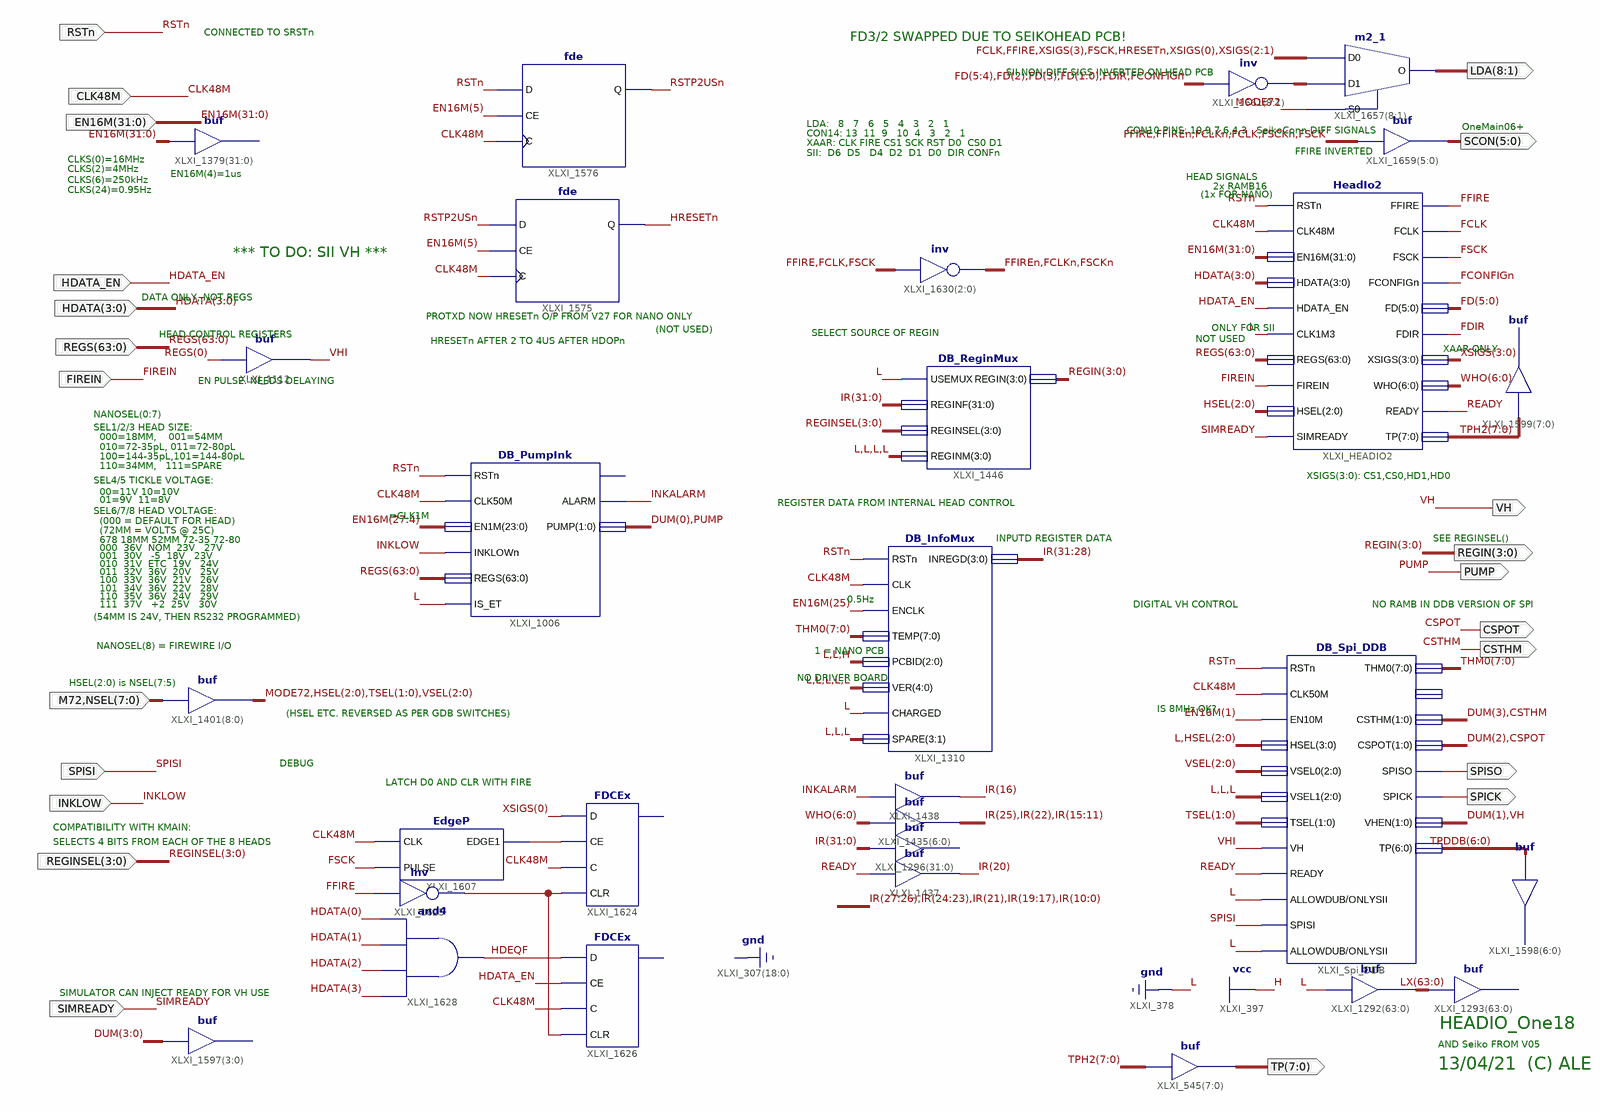
[diagram p0: schematic sheet 1]
// Xilinx ISE schematic HeadIo_One18.sch (spartan3e) as structural Verilog: 29 symbols, 22 ports
module HeadIo_One18 (
  input  CLK48M,
  input  RSTn,
  input  [3:0] HDATA,
  input  HDATA_EN,
  input  FIREIN,
  input  [63:0] REGS,
  input  INKLOW,
  input  M72,
  input  [7:0] NSEL,
  input  [3:0] REGINSEL,
  input  [31:0] EN16M,
  input  SPISI,
  input  SIMREADY,
  output [7:0] TP,
  output [3:0] REGIN,
  output PUMP,
  output VH,
  output SPISO,
  output SPICK,
  output [5:0] SCON,
  output [8:1] LDA,
  output CSPOT,
  output CSTHM
);

  wire FCLK, FCLKn, FCONFIGn, FDIR, FFIRE, FFIREn, FSCK, FSCKn, HDEQF, HRESETn, INKALARM, MODE72, READY,
       RSTP2USn, VHI, XLXN_68, XLXN_73;
  wire [1:0] TSEL;
  wire [2:0] HSEL, VSEL;
  wire [3:0] DUM, XSIGS;
  wire [5:0] FD;
  wire [6:0] TPDDB, WHO;
  wire [7:0] THM0, TPH2;
  wire [8:1] XLXN_75;
  wire [31:11] IR;
  wire [63:0] LX;

  assign TP = TPH2;  // buf XLXI_545[7..0], 8 bits wide
  assign {MODE72, HSEL, TSEL, VSEL} = {M72, NSEL};  // buf XLXI_1401[8..0], 9 bits wide
  // buf XLXI_1379[31..0] has open pins: I=EN16M, O=open
  fde XLXI_1575 (.C(CLK48M), .CE(EN16M[5]), .D(RSTP2USn), .Q(HRESETn));
  fde XLXI_1576 (.C(CLK48M), .CE(EN16M[5]), .D(RSTn), .Q(RSTP2USn));
  buf XLXI_1112 (VHI, REGS[0]);
  DB_PumpInk XLXI_1006 (
    .ALARM(INKALARM), .CLK50M(CLK48M), .EN1M(EN16M[27:4]), .INKLOWn(INKLOW), .IS_ET(1'b0),
    .PUMP({DUM[0], PUMP}), .REGS(REGS), .RSTn(RSTn));  // open: LEDINK
  // buf XLXI_1598[6..0] has open pins: I=TPDDB, O=open
  EdgeP XLXI_1607 (.CLK(CLK48M), .EDGE1(XLXN_68), .PULSE(FSCK));
  FDCEx XLXI_1624 (.C(CLK48M), .CE(XLXN_68), .CLR(XLXN_73), .D(XSIGS[0]));  // open: Q
  not XLXI_1625 (XLXN_73, FFIRE);
  FDCEx XLXI_1626 (.C(CLK48M), .CE(HDATA_EN), .CLR(XLXN_73), .D(HDEQF));  // open: Q
  and XLXI_1628 (HDEQF, HDATA[3], HDATA[2], HDATA[1], HDATA[0]);
  DB_ReginMux XLXI_1446 (
    .REGIN(REGIN),
    .REGINF({IR[31:28], 2'b00, IR[25], 2'b00, IR[22], 1'b0, IR[20], 3'b000, IR[16:11], {11{1'b0}}}),
    .REGINM(4'b0000), .REGINSEL(REGINSEL), .USEMUX(1'b0));
  buf XLXI_1437 (IR[20], READY);
  // buf XLXI_1296[31..0] has open pins: I={IR[31:28], 2'b00, IR[25], 2'b00, IR[22], 1'b0, IR[20], 3'b000, IR[16:11], {11{1'b0}}}, O=open
  assign {IR[25], IR[22], IR[15:11]} = WHO;  // buf XLXI_1435[6..0], 7 bits wide
  buf XLXI_1438 (IR[16], INKALARM);
  DB_InfoMux XLXI_1310 (
    .CLK(CLK48M), .ENCLK(EN16M[25]), .INREGD(IR[31:28]), .PCBID(3'b001), .RSTn(RSTn), .CHARGED(1'b0),
    .SPARE(3'b000), .TEMP(THM0), .VER({5{1'b0}}));
  assign {FFIREn, FCLKn, FSCKn} = ~{FFIRE, FCLK, FSCK};  // inv XLXI_1630[2..0], 3 bits wide
  // buf XLXI_1599[7..0] has open pins: I=TPH2, O=open
  HeadIo2 XLXI_HEADIO2 (
    .CLK1M3(1'b0), .CLK48M(CLK48M), .EN16M(EN16M), .FCLK(FCLK), .FCONFIGn(FCONFIGn), .FD(FD), .FDIR(FDIR),
    .FFIRE(FFIRE), .FIREIN(FIREIN), .FSCK(FSCK), .HDATA(HDATA), .HDATA_EN(HDATA_EN), .HSEL(HSEL),
    .READY(READY), .REGS(REGS), .RSTn(RSTn), .SIMREADY(SIMREADY), .TP(TPH2), .WHO(WHO), .XSIGS(XSIGS));
  // buf XLXI_1597[3..0] has open pins: I=DUM, O=open
  assign SCON = {FFIRE, FFIREn, FCLKn, FCLK, FSCKn, FSCK};  // buf XLXI_1659[5..0], 6 bits wide
  assign XLXN_75 = ~{FD[5:4], FD[2], FD[3], FD[1:0], FDIR, FCONFIGn};  // inv XLXI_1661[8..1], 8 bits wide
  m2_1 XLXI_1657[8:1] (
    .D0({FCLK, FFIRE, XSIGS[3], FSCK, HRESETn, XSIGS[0], XSIGS[2:1]}), .D1(XLXN_75), .S0(MODE72), .O(LDA));
  assign LX = {64{1'b0}};  // buf XLXI_1292[63..0], 64 bits wide
  // buf XLXI_1293[63..0] has open pins: I=LX, O=open
  DB_Spi_DDB XLXI_Spi_DDB (
    .ALLOWDUB(1'b0), .CLK50M(CLK48M), .CSPOT({DUM[2], CSPOT}), .CSTHM({DUM[3], CSTHM}), .EN10M(EN16M[1]),
    .HSEL({1'b0, HSEL}), .ONLYSII(1'b0), .READY(READY), .RSTn(RSTn), .SPICK(SPICK), .SPISI(SPISI),
    .SPISO(SPISO), .THM0(THM0), .TP(TPDDB), .TSEL(TSEL), .VH(VHI), .VHEN({DUM[1], VH}), .VSEL0(VSEL),
    .VSEL1(3'b000));  // open: THM1

  // Notes on the sheet:
  //   CONNECTED TO SRSTn
  //   FD3/2 SWAPPED DUE TO SEIKOHEAD PCB!
  //   SII NON-DIFF SIGS INVERTED ON HEAD PCB
  //   LDA:   8   7   6   5   4   3   2   1
  //   OneMain06+
  //   CON10 PINS: 10,9,7,6,4,3
  //   SeikoConn DIFF SIGNALS
  //   CON14: 13  11  9   10  4   3   2   1
  //   XAAR: CLK FIRE CS1 SCK RST D0  CS0 D1
  //   FFIRE INVERTED
  //   SII:  D6  D5   D4  D2  D1  D0  DIR CONFn
  //   CLKS(0)=16MHz
  //   CLKS(2)=4MHz
  //   EN16M(4)=1us
  //   HEAD SIGNALS
  //   CLKS(6)=250kHz
  //   2x RAMB16
  //   CLKS(24)=0.95Hz
  //   (1x FOR NANO)
  //   *** TO DO: SII VH ***
  //   DATA ONLY, NOT REGS
  //   PROTXD NOW HRESETn O/P FROM V27 FOR NANO ONLY
  //   ONLY FOR SII
  //   (NOT USED)
  //   SELECT SOURCE OF REGIN
  //   HEAD CONTROL REGISTERS
  //   NOT USED
  //   HRESETn AFTER 2 TO 4US AFTER HDOPn
  //   XAAR ONLY
  //   EN PULSE. NEEDS DELAYING
  //   NANOSEL(0:7)
  //   SEL1/2/3 HEAD SIZE:
  //   000=18MM,    001=54MM
  //   010=72-35pL, 011=72-80pL
  //   100=144-35pL,101=144-80pL
  //   110=34MM,   111=SPARE
  //   XSIGS(3:0): CS1,CS0,HD1,HD0
  //   SEL4/5 TICKLE VOLTAGE:
  //   00=11V 10=10V
  //   01=9V  11=8V
  //   REGISTER DATA FROM INTERNAL HEAD CONTROL
  //   SEL6/7/8 HEAD VOLTAGE:
  //   =CLK1M
  //   (000 = DEFAULT FOR HEAD)
  //   (72MM = VOLTS @ 25C)
  //   INPUTD REGISTER DATA
  //   SEE REGINSEL()
  //   678 18MM 52MM 72-35 72-80
  //   000  36V  NOM  23V   27V
  //   001  30V   -5  18V   23V
  //   010  31V  ETC  19V   24V
  //   011  32V  36V  20V   25V
  //   100  33V  36V  21V   26V
  //   101  34V  36V  22V   28V
  //   110  35V  36V  24V   29V
  //   0.5Hz
  //   111  37V   +2  25V   30V
  //   DIGITAL VH CONTROL
  //   NO RAMB IN DDB VERSION OF SPI
  //   (54MM IS 24V, THEN RS232 PROGRAMMED)
  //   NANOSEL(8) = FIREWIRE I/O
  //   1 = NANO PCB
  //   NO DRIVER BOARD
  //   HSEL(2:0) is NSEL(7:5)
  //   IS 8MHz OK?
  //   (HSEL ETC. REVERSED AS PER GDB SWITCHES)
  //   DEBUG
  //   LATCH D0 AND CLR WITH FIRE
  //   COMPATIBILITY WITH KMAIN:
  //   SELECTS 4 BITS FROM EACH OF THE 8 HEADS
  //   SIMULATOR CAN INJECT READY FOR VH USE
  //   HEADIO_One18
  //   AND Seiko FROM V05
  //   13/04/21  (C) ALE
endmodule
